# Altium schematic sheet buttons.SchDoc
size A4; DocumentNumber: 3; SheetNumber: 3; SheetTotal: 5
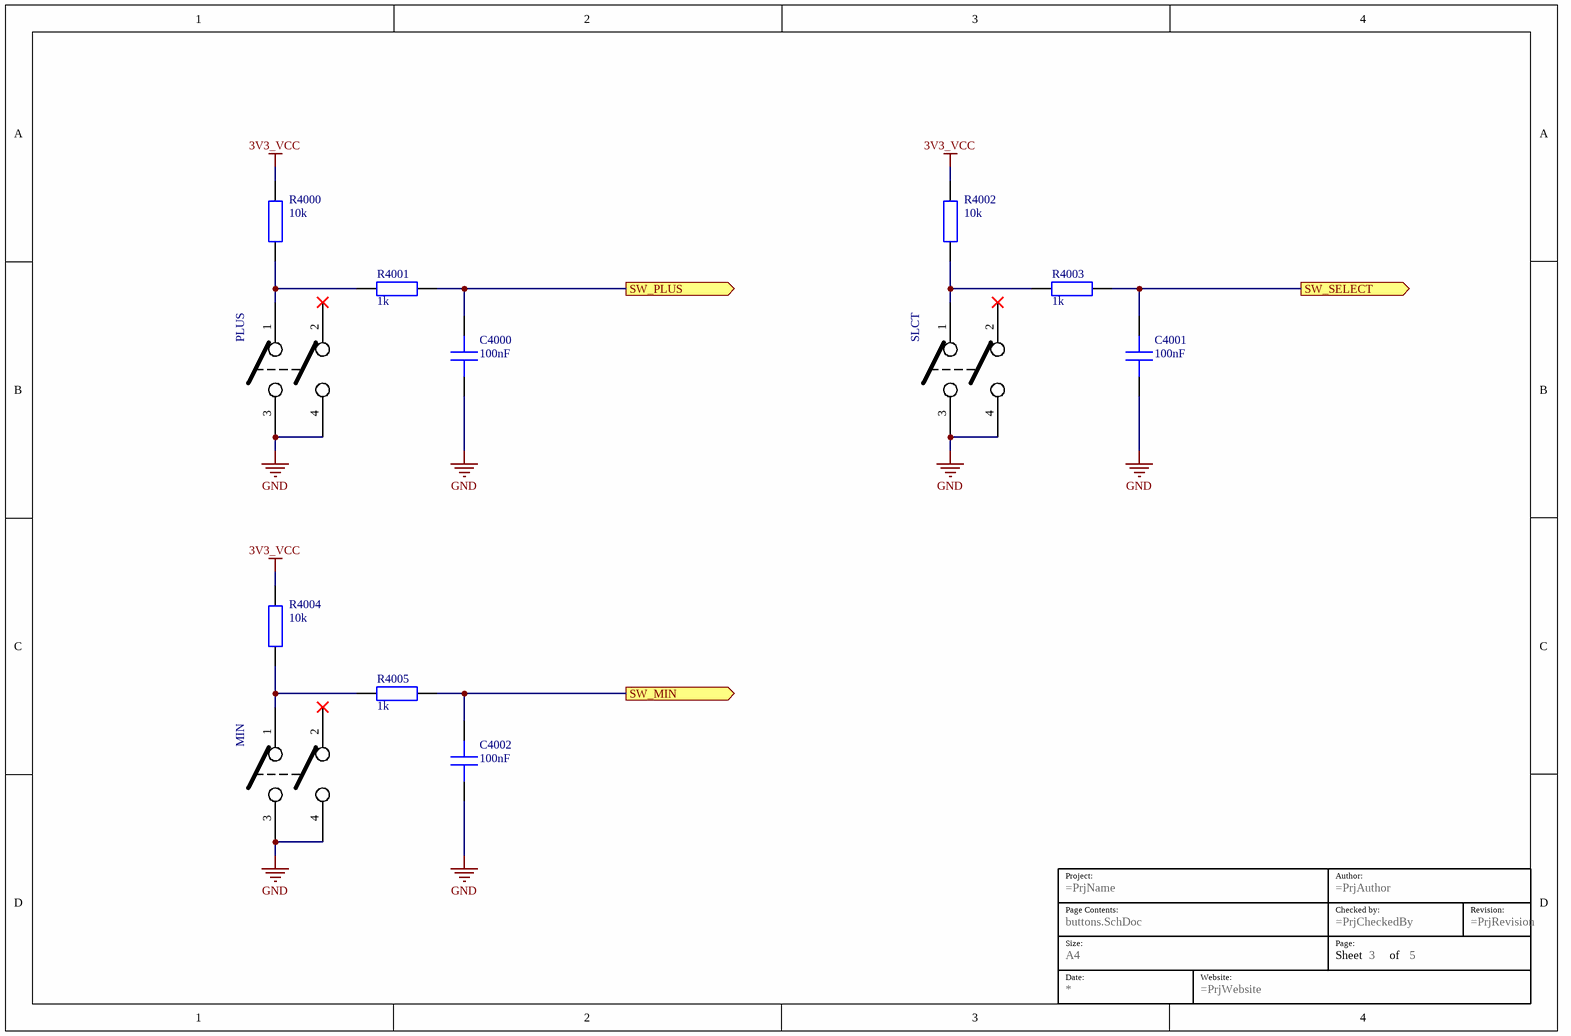
[diagram p0: buttons.SchDoc]

## Parts
*?  Size: A4  (hidden comment: TITLE BLOCK)  (graphical)
C4000  100nF  [TH-CAPACITOR - ANGLE]
C4001  100nF  [TH-CAPACITOR - ANGLE]
C4002  100nF  [TH-CAPACITOR - ANGLE]
MIN  PUSHBUTTON  [TH-PUSHBUTTON]  (value not drawn)
PLUS  PUSHBUTTON  [TH-PUSHBUTTON]  (value not drawn)
R4000  10k  [AXIAL RESISTOR]
R4001  1k  [AXIAL RESISTOR]
R4002  10k  [AXIAL RESISTOR]
R4003  1k  [AXIAL RESISTOR]
R4004  10k  [AXIAL RESISTOR]
R4005  1k  [AXIAL RESISTOR]
SLCT  PUSHBUTTON  [TH-PUSHBUTTON]  (value not drawn)

## Ports
SW_MIN (out), SW_PLUS (out), SW_SELECT (out)

## Nets
3V3_VCC: R4000.1 R4002.1 R4004.1
GND: C4000.2 C4001.2 C4002.2 MIN.3 MIN.4 PLUS.3 PLUS.4 SLCT.3 SLCT.4
SW_MIN: C4002.1 R4005.1 ; port SW_MIN
SW_PLUS: C4000.1 R4001.1 ; port SW_PLUS
SW_SELECT: C4001.1 R4003.1 ; port SW_SELECT
NetMIN_1: MIN.1 R4004.2 R4005.2
NetPLUS_1: PLUS.1 R4000.2 R4001.2
NetR4002_2: R4002.2 R4003.2 SLCT.1

Not connected (* = marked no-connect by the designer): MIN 2*; PLUS 2*; SLCT 2*

## Notes on the sheet
- (in symbol TITLE BLOCK) Project:; Author:; Page Contents:; Checked by:; Revision:; Size:; Page:; Sheet; of; Date:; Website:

## Library data of the parts
C4000-C4002 = CAPACITOR: GENERIC CAPACITOR
R4000-R4005 = RESISTOR: GENERIC RESISTOR